# EAGLE design xmega1 (EAGLE 8.4.0)
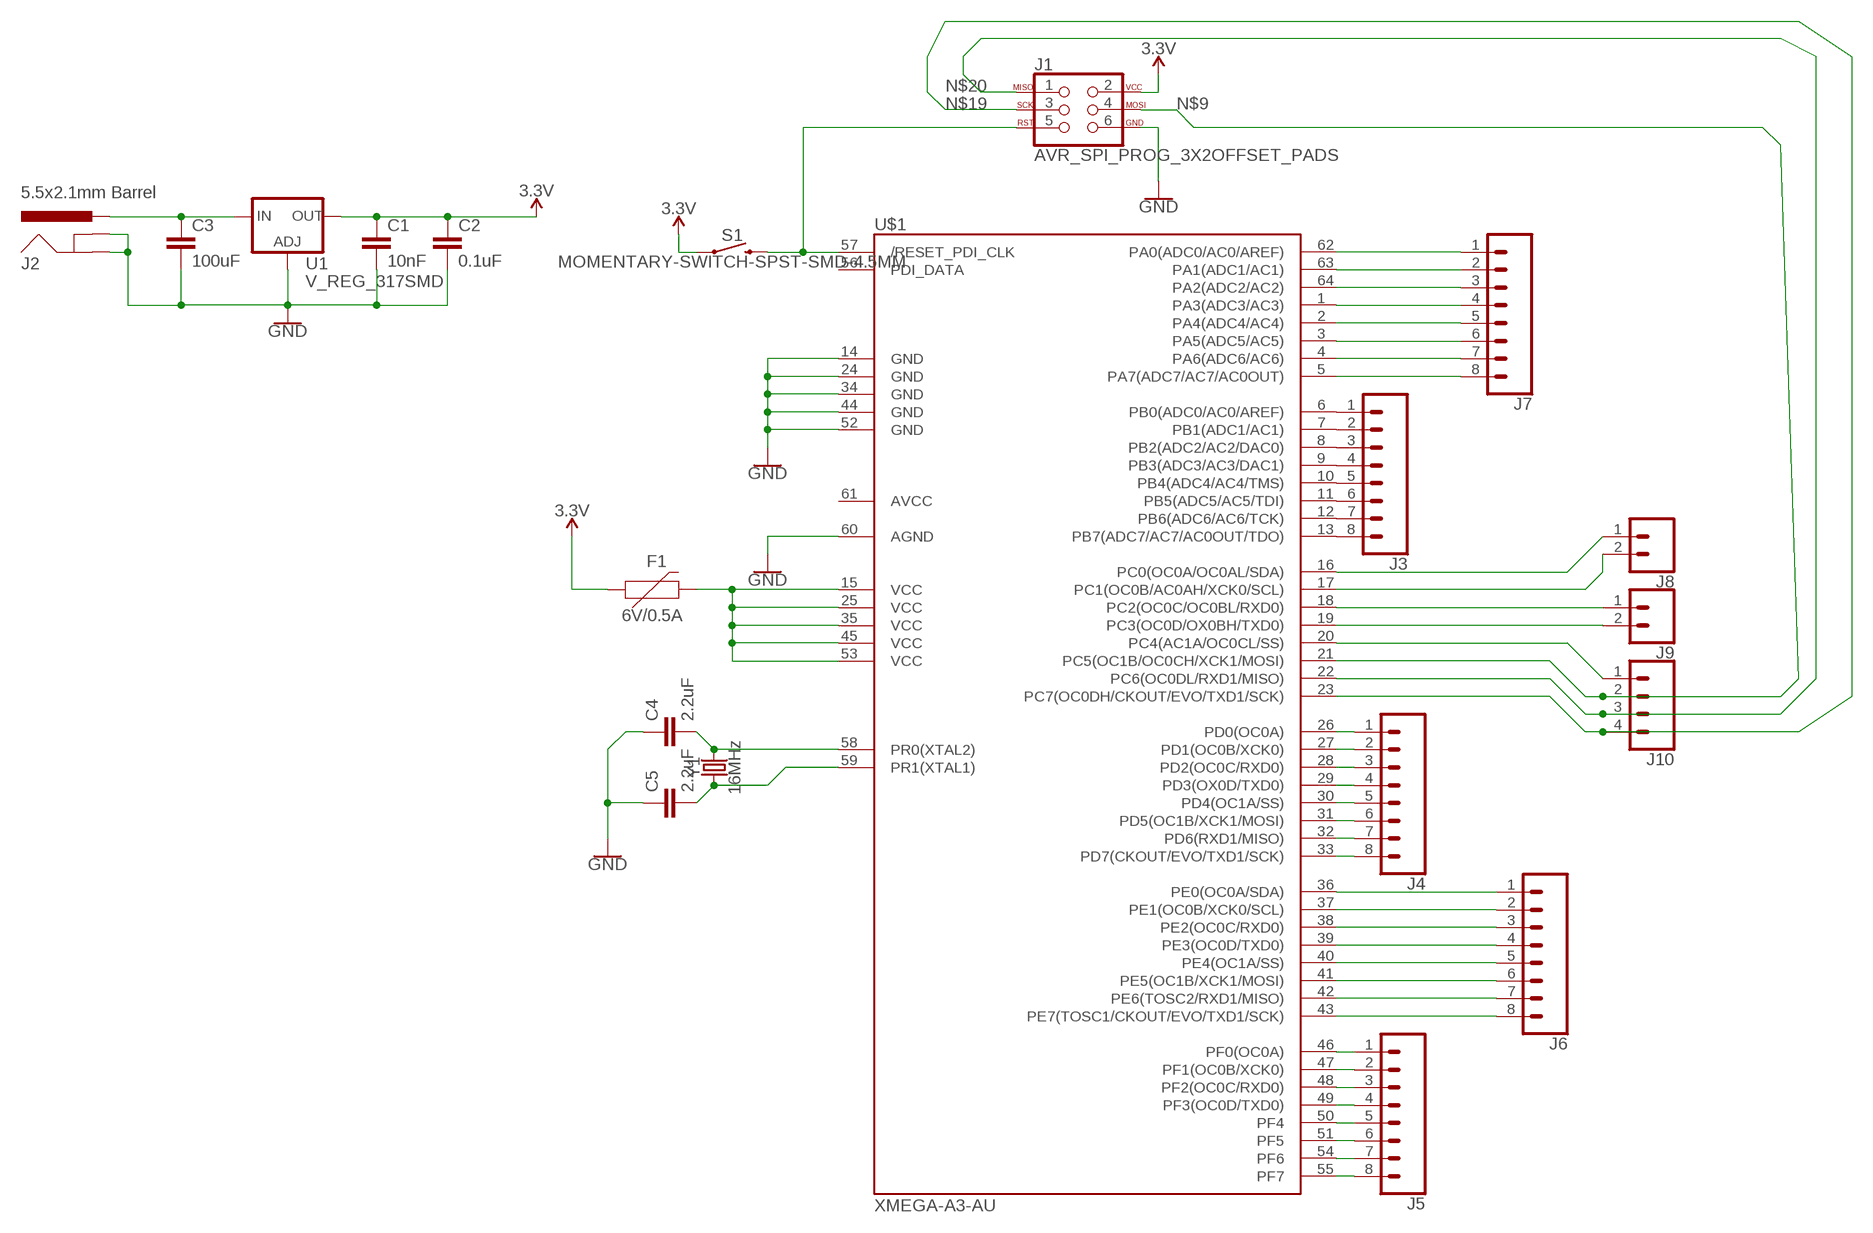
[diagram p0: schematic, sheet 1]

## Parts
C1  10nF  10NF-0603-50V-10%  [0603]
C2  0.1uF  .1UF-CER  [0402-CAP]
C3  100uF  100UF6.3V20%(1210)  [1210]
C4  2.2uF  2.2UF-CERCAP-07888  [0402-CAP]
C5  2.2uF  2.2UF-CERCAP-07888  [0402-CAP]
F1  6V/0.5A  PPTC_HALF-AMP  [1206]
J1  AVR_SPI_PROG_3X2OFFSET_PADS  [2X3_OFFSET]
J2  5.5x2.1mm Barrel  POWER_JACKSMD  [POWER_JACK_SMD]
J3  CONN_08LONGPADS  [1X08_LONGPADS]
J4  CONN_08LONGPADS  [1X08_LONGPADS]
J5  CONN_08LONGPADS  [1X08_LONGPADS]
J6  CONN_08LONGPADS  [1X08_LONGPADS]
J7  CONN_08LONGPADS  [1X08_LONGPADS]
J8  CONN_02PTH3  [1X02_LONGPADS]
J9  CONN_02PTH3  [1X02_LONGPADS]
J10  CONN_04LONGPADS  [1X04_LONGPADS]
S1  MOMENTARY-SWITCH-SPST-SMD-4.5MM  [TACTILE_SWITCH_SMD_4.5MM]
U1  V_REG_317SMD  [SOT223]
U$1  XMEGA-A3-AU  [TQFP64_14X14MM_MCU]
Y1  16MHz  CRYSTAL-16MHZSMD-5X3.2  [CRYSTAL-SMD-5X3.2-4PAD]

## Nets
3.3V: C1.1 C2.1 F1.1 J1.2 S1.2 S1.3 U1.2(OUT)
GND: C1.2 C2.2 C3.2 C4.1 C5.1 J1.6 J2.GND(GNDBREAK) J2.P$4(GND) U1.1(ADJ) U$1.14(GND1) U$1.24(GND2) U$1.34(GND3) U$1.44(GND4) U$1.52(GND5) U$1.60(AGND)
N$1: F1.2 U$1.15(VCC1) U$1.25(VCC2) U$1.35(VCC3) U$1.45(VCC4) U$1.53(VCC5)
N$2: J1.5 S1.1 S1.4 U$1.57(/RESET_PDI_CLK)
N$3: J8.1 U$1.16(PC0(OC0A/OC0AL/SDA))
N$4: C3.1 J2.VIN0(PWR) U1.3(IN)
N$5: J8.2 U$1.17(PC1(OC0B/AC0AH/XCK0/SCL))
N$6: C5.2 U$1.59(PR1(XTAL1)) Y1.1
N$7: C4.2 U$1.58(PR0(XTAL2)) Y1.3
N$8: J3.1 U$1.6(PB0(ADC0/AC0/AREF))
N$9: J1.4 J10.2 U$1.21(PC5(OC1B/OC0CH/XCK1/MOSI))
N$10: J7.1 U$1.62(PA0(ADC0/AC0/AREF))
N$11: J7.2 U$1.63(PA1(ADC1/AC1))
N$12: J7.3 U$1.64(PA2(ADC2/AC2))
N$13: J7.4 U$1.1(PA3(ADC3/AC3))
N$14: J7.5 U$1.2(PA4(ADC4/AC4))
N$15: J7.6 U$1.3(PA5(ADC5/AC5))
N$16: J6.1 U$1.36(PE0(OC0A/SDA))
N$17: J6.2 U$1.37(PE1(OC0B/XCK0/SCL))
N$18: J9.1 U$1.18(PC2(OC0C/OC0BL/RXD0))
N$19: J1.3 J10.4 U$1.23(PC7(OC0DH/CKOUT/EVO/TXD1/SCK))
N$20: J1.1 J10.3 U$1.22(PC6(OC0DL/RXD1/MISO))
N$21: J9.2 U$1.19(PC3(OC0D/OX0BH/TXD0))
N$22: J3.2 U$1.7(PB1(ADC1/AC1))
N$23: J3.3 U$1.8(PB2(ADC2/AC2/DAC0))
N$24: J3.4 U$1.9(PB3(ADC3/AC3/DAC1))
N$25: J3.5 U$1.10(PB4(ADC4/AC4/TMS))
N$26: J3.6 U$1.11(PB5(ADC5/AC5/TDI))
N$27: J3.7 U$1.12(PB6(ADC6/AC6/TCK))
N$28: J3.8 U$1.13(PB7(ADC7/AC7/AC0OUT/TDO))
N$29: J7.7 U$1.4(PA6(ADC6/AC6))
N$30: J7.8 U$1.5(PA7(ADC7/AC7/AC0OUT))
N$31: J4.1 U$1.26(PD0(OC0A))
N$32: J4.2 U$1.27(PD1(OC0B/XCK0))
N$33: J4.3 U$1.28(PD2(OC0C/RXD0))
N$34: J4.4 U$1.29(PD3(OX0D/TXD0))
N$35: J4.5 U$1.30(PD4(OC1A/SS))
N$36: J4.6 U$1.31(PD5(OC1B/XCK1/MOSI))
N$37: J4.7 U$1.32(PD6(RXD1/MISO))
N$38: J4.8 U$1.33(PD7(CKOUT/EVO/TXD1/SCK))
N$39: J6.3 U$1.38(PE2(OC0C/RXD0))
N$40: J6.4 U$1.39(PE3(OC0D/TXD0))
N$41: J6.5 U$1.40(PE4(OC1A/SS))
N$42: J6.6 U$1.41(PE5(OC1B/XCK1/MOSI))
N$43: J6.7 U$1.42(PE6(TOSC2/RXD1/MISO))
N$44: J6.8 U$1.43(PE7(TOSC1/CKOUT/EVO/TXD1/SCK))
N$45: J5.1 U$1.46(PF0(OC0A))
N$46: J5.2 U$1.47(PF1(OC0B/XCK0))
N$47: J5.3 U$1.48(PF2(OC0C/RXD0))
N$48: J5.4 U$1.49(PF3(OC0D/TXD0))
N$49: J5.5 U$1.50(PF4)
N$50: J5.6 U$1.51(PF5)
N$51: J5.7 U$1.54(PF6)
N$52: J5.8 U$1.55(PF7)
N$53: J10.1 U$1.20(PC4(AC1A/OC0CL/SS))
Unconnected: U$1.56(PDI_DATA) U$1.61(AVCC)

## Library data of the parts
C1 = SparkFun-Capacitors:10NF: 0.01uF/10nF/10,000pF ceramic capacitors A capacitor is a passive two-terminal electrical component used to store electrical energy temporarily in an electric field. CAP-09321; PROD_ID: CAP-00867
C2 = SparkFun-Retired:.1UF-CER: .1uF ceramic SMT CAP-00810- 25V +80%/-20% (0603) CAP-08390- 100V 10% (0603) CAP-08604- 25V 5% (0603); PROD_ID: CAP-00810
C3 = SparkFun-Retired:100UF6.3V20%(1210): CAP-09827; PROD_ID: CAP-09827
C4 C5 = SparkFun-Retired:2.2UF-CER: 2.2uF Ceramic SMT CAP-07888- 10V, 20% (0603) CAP-10009- 50V, 10% (1206); PROD_ID: CAP-07888
F1 = SparkFun-Fuses:PPTC: Resettable Fuse PPTC Resettable Fuse. Really a sort of resistor with a polymeric positive temperature coefficient whose resistance increases dramatically with an increase in temperature. When heated by the power passing through the resistance rises causing the current to be limited, protecting the circuit. This is achieved by the transition of the polymer from a crystalline to an amorphous state where the conductive carbon separates breaking the conductive pathways found in the cool crystalline structure. When a PPTC cools back down it resumes conducting letting the circuit turn back on. SparkFun Products: SparkFun RedBoard - Programmed with Arduino <https://www.sparkfun.com/products/12757> Pro Micro - 5V/16MHz <https://www.sparkfun.com/products/12640> Arduino Pro 328 - 5V/16MHz <https://www.sparkfun.com/products/10915> MP3 Trigger <https://www.sparkfun.com/products/13720>; PROD_ID: RES-08585
J1 = SparkFun-Connectors:AVR_SPI_PROG_3X2: AVR ISP 6 Pin This is the reduced ISP connector for AVR programming. Common on Arduino. This footprint will take up less PCB space and can be used with a 10-pin to 6-pin adapter such as SKU: BOB-08508 **Special note about "TEST_POINT" package. The stop mask is on the top side, so if you want your programming test points to be on the bottom of your board, make sure to place this package on the bottom side of the board. This also ensure that the orientation to program from the bottom side will be correct. SparkFun Products: SparkFun ISP Pogo Adapter <https://www.sparkfun.com/products/11591> - NS Tiny AVR Programmer <https://www.sparkfun.com/products/11801> -PTH
J2 = SparkFun-Connectors:POWER_JACK: Power Jack Connector This is the standard 5.5mm barrel jack for power. The PTH is the most common, proven, reliable, footprint. The Slot footprint only works if the mill layer is transmitted to the PCB fab house so be warned. Here are the connectors we sell at SparkFun: DC Barrel Power Jack/Connector <https://www.sparkfun.com/products/119> (PRT-00119) DC Barrel Power Jack/Connector (SMD) <https://www.sparkfun.com/products/12748> (PRT-12748) DC Barrel Jack Adapter - Breadboard Compatible <https://www.sparkfun.com/products/10811> (PRT-10811) It is used on this SparkFun product (and many, many others): SparkFun RedBoard - Programmed with Arduino <https://www.sparkfun.com/products/12757> (DEV-12757) Also, if you need a mating power supply or connector, please check these out: Wall Adapter Power Supply - 9VDC 650mA <https://www.sparkfun.com/products/298> (TOL-00298) DC Barrel Jack Adapter - Male <https://www.sparkfun.com/products/10287> (PRT-10287); PROD_ID: CONN-08106; SF_ID: PRT-12748
J3-J7 = SparkFun-Connectors:CONN_08: Multi connection point. Often used as Generic Header-pin footprint for 0.1 inch spaced/style header connections On any of the 0.1 inch spaced packages, you can populate with these: Break Away Headers - Straight <https://www.sparkfun.com/products/116> (PRT-00116) Break Away Male Headers - Right Angle <https://www.sparkfun.com/products/553> (PRT-00553) Female Headers <https://www.sparkfun.com/products/115> (PRT-00115) Break Away Headers - Machine Pin <https://www.sparkfun.com/products/117> (PRT-00117) Break Away Female Headers - Swiss Machine Pin <https://www.sparkfun.com/products/743> (PRT-00743) Arduino Stackable Header - 8 Pin <https://www.sparkfun.com/products/9279> (PRT-09279) For SCREWTERMINALS and SPRING TERMINALS visit here: Screw Terimnals on SparkFun.com <https://www.sparkfun.com/search/results?term=Screw+Terminals> (5mm/3.5mm/2.54mm spacing) This device is also useful as a general connection point to wire up your design to another part of your project. Our various solder wires solder well into these plated through hole pads. Hook-Up Wire - Assortment (Stranded, 22 AWG) <https://www.sparkfun.com/products/11375> (PRT-11375) Hook-Up Wire - Assortment (Solid Core, 22 AWG) <https://www.sparkfun.com/products/11367> (PRT-11367) View the entire wire category on our website here <https://www.sparkfun.com/categories/141> Special notes: Molex polarized connector foot print use with SKU : PRT-08231 with associated crimp pins and housings. 1MM SMD Version SKU: PRT-10208 NOTES ON THE VARIANTS LOCK and LOCK_LONGPADS... This footprint was designed to help hold the alignment of a through-hole component (i.e. 6-pin header) while soldering it into place. You may notice that each hole has been shifted either up or down by 0.005 of an inch from it's more standard position (which is a perfectly straight line). This slight alteration caused the pins (the squares in the middle) to touch the edges of the holes. Because they are alternating, it causes a "brace" to hold the component in place. 0.005 has proven to be the perfect amount of "off-center" position when using our standard breakaway headers. Although looks a little odd when you look at the bare footprint, once you have a header in there, the alteration is very hard to notice. Also,if you push a header all the way into place, it is covered up entirely on the bottom side.
J8 J9 = SparkFun-Connectors:CONN_02: Multi connection point. Often used as Generic Header-pin footprint for 0.1 inch spaced/style header connections On any of the 0.1 inch spaced packages, you can populate with these: Break Away Headers - Straight <https://www.sparkfun.com/products/116> (PRT-00116) Break Away Male Headers - Right Angle <https://www.sparkfun.com/products/553> (PRT-00553) Female Headers <https://www.sparkfun.com/products/115> (PRT-00115) Break Away Headers - Machine Pin <https://www.sparkfun.com/products/117> (PRT-00117) Break Away Female Headers - Swiss Machine Pin <https://www.sparkfun.com/products/743> (PRT-00743) For SCREWTERMINALS and SPRING TERMINALS visit here: Screw Terimnals on SparkFun.com <https://www.sparkfun.com/search/results?term=Screw+Terminals> (5mm/3.5mm/2.54mm spacing) This device is also useful as a general connection point to wire up your design to another part of your project. Our various solder wires solder well into these plated through hole pads. Hook-Up Wire - Assortment (Stranded, 22 AWG) <https://www.sparkfun.com/products/11375> (PRT-11375) Hook-Up Wire - Assortment (Solid Core, 22 AWG) <https://www.sparkfun.com/products/11367> (PRT-11367) View the entire wire category on our website here <https://www.sparkfun.com/categories/141> Special notes: Molex polarized connector foot print use with: PRT-08233 with associated crimp pins and housings. 2.54_SCREWTERM for use with PRT-10571. 3.5mm Screw Terminal footprints for PRT-08084 5mm Screw Terminal footprints for use with PRT-08432
J10 = SparkFun-Connectors:CONN_04: Multi connection point. Often used as Generic Header-pin footprint for 0.1 inch spaced/style header connections On any of the 0.1 inch spaced packages, you can populate with these: Break Away Headers - Straight <https://www.sparkfun.com/products/116> (PRT-00116) Break Away Male Headers - Right Angle <https://www.sparkfun.com/products/553> (PRT-00553) Female Headers <https://www.sparkfun.com/products/115> (PRT-00115) Break Away Headers - Machine Pin <https://www.sparkfun.com/products/117> (PRT-00117) Break Away Female Headers - Swiss Machine Pin <https://www.sparkfun.com/products/743> (PRT-00743) For SCREWTERMINALS and SPRING TERMINALS visit here: Screw Terimnals on SparkFun.com <https://www.sparkfun.com/search/results?term=Screw+Terminals> (5mm/3.5mm/2.54mm spacing) This device is also useful as a general connection point to wire up your design to another part of your project. Our various solder wires solder well into these plated through hole pads. Hook-Up Wire - Assortment (Stranded, 22 AWG) <https://www.sparkfun.com/products/11375> (PRT-11375) Hook-Up Wire - Assortment (Solid Core, 22 AWG) <https://www.sparkfun.com/products/11367> (PRT-11367) View the entire wire category on our website here <https://www.sparkfun.com/categories/141> Special notes: Molex polarized connector foot print use with SKU : PRT-08231 with associated crimp pins and housings. 1MM SMD Version SKU: PRT-10208; PROD_ID: CONN-09696
S1 = SparkFun-Switches:MOMENTARY-SWITCH-SPST: Momentary Switch (Pushbutton) - SPST Normally-open (NO) SPST momentary switches (buttons, pushbuttons). Variants PTH-12MM - 12mm square, through-hole Momentary Pushbutton Switch - 12mm Square <https://www.sparkfun.com/products/9190> (COM-09190) PTH-6.0MM, PTH-6.0MM-KIT - 6.0mm square, through-hole Mini Pushbutton Switch <https://www.sparkfun.com/products/97> (COM-00097) KIT package intended for soldering kit's - only one side of pads' copper is exposed. PTH-RIGHT-ANGLE-KIT - Right-angle, through-hole Right Angle Tactile Button <https://www.sparkfun.com/products/10791> - Used on SparkFun BigTime Watch Kit <https://www.sparkfun.com/products/11734> SMD-12MM - 12mm square, surface-mount Tactile Button - SMD (12mm) <https://www.sparkfun.com/products/12993> (COM-12993) Used on SparkFun PicoBoard <https://www.sparkfun.com/products/11888> SMD-4.5MM - 4.5mm Square Trackball Switch Used on SparkFun Blackberry Trackballer Breakout <https://www.sparkfun.com/products/13169> SMD-4.6MMX2.8MM - 4.60mm x 2.80mm, surface mount Used on SparkFun SAMD21 Mini Breakout <https://www.sparkfun.com/products/13664> SMD-5.2MM, SMD-5.2-REDUNDANT - 5.2mm square, surface-mount Mini Pushbutton Switch - SMD <https://www.sparkfun.com/products/8720> (COM-08720) Used on Arduino Pro Mini <https://www.sparkfun.com/products/11114> REDUNDANT package connects both switch circuits together SMD-6.0X3.5MM - 6.0 x 3.5mm, surface mount Momentary Reset Switch SMD <https://www.sparkfun.com/products/8229> (COM-08229) SMD-6.2MM-TALL - 6.2mm square, surface mount Tactile Button - SMD (6mm) <https://www.sparkfun.com/products/12992> Used on SparkFun Digital Sandbox <https://www.sparkfun.com/products/12651> SMD-RIGHT-ANGLE - Right-angle, surface mount Used on SparkFun Block for Intel® Edison - Arduino <https://www.sparkfun.com/products/13036>; PROD_ID: SWCH-09213
U1 = SparkFun-IC-Power:V_REG_317: Voltage Regulator Standard LM317 adjustable voltage regulator. AOI (Adjust Output Input). Google 'LM317 Calculator' for easy to use app to get the two resistor values needed. 240/720 for 5V output. 240/390 for 3.3V output. Spark Fun Electronics SKU : COM-00527
U$1 = SparkFun-Retired:XMEGA-A3: Atmel's 8/16-bit AVR XMEGA A3 Microcontroller - ATxmega256A3, etc. Retired: IC-09806 - ATXMEGA256A3 Retired: IC-09429 - ATXMEGA128A1
Y1 = SparkFun-Clocks:CRYSTAL-16MHZ: 16MHz Crystal Digikey Example <http://www.digikey.com/product-search/en?keywords=535-9122-1-ND> Frequency: 16MHz Frequency Stability: ±50ppm Frequency Tolerance: ±20ppm Load Capacitance: 18pF SparkFun Products: Pro Micro -5V/16MHz <https://www.sparkfun.com/products/12640> SparkFun Serial Enabled LCD Kit <https://www.sparkfun.com/products/10097>; PROD_ID: XTAL-08218; SF_ID: COM-00094

## Board
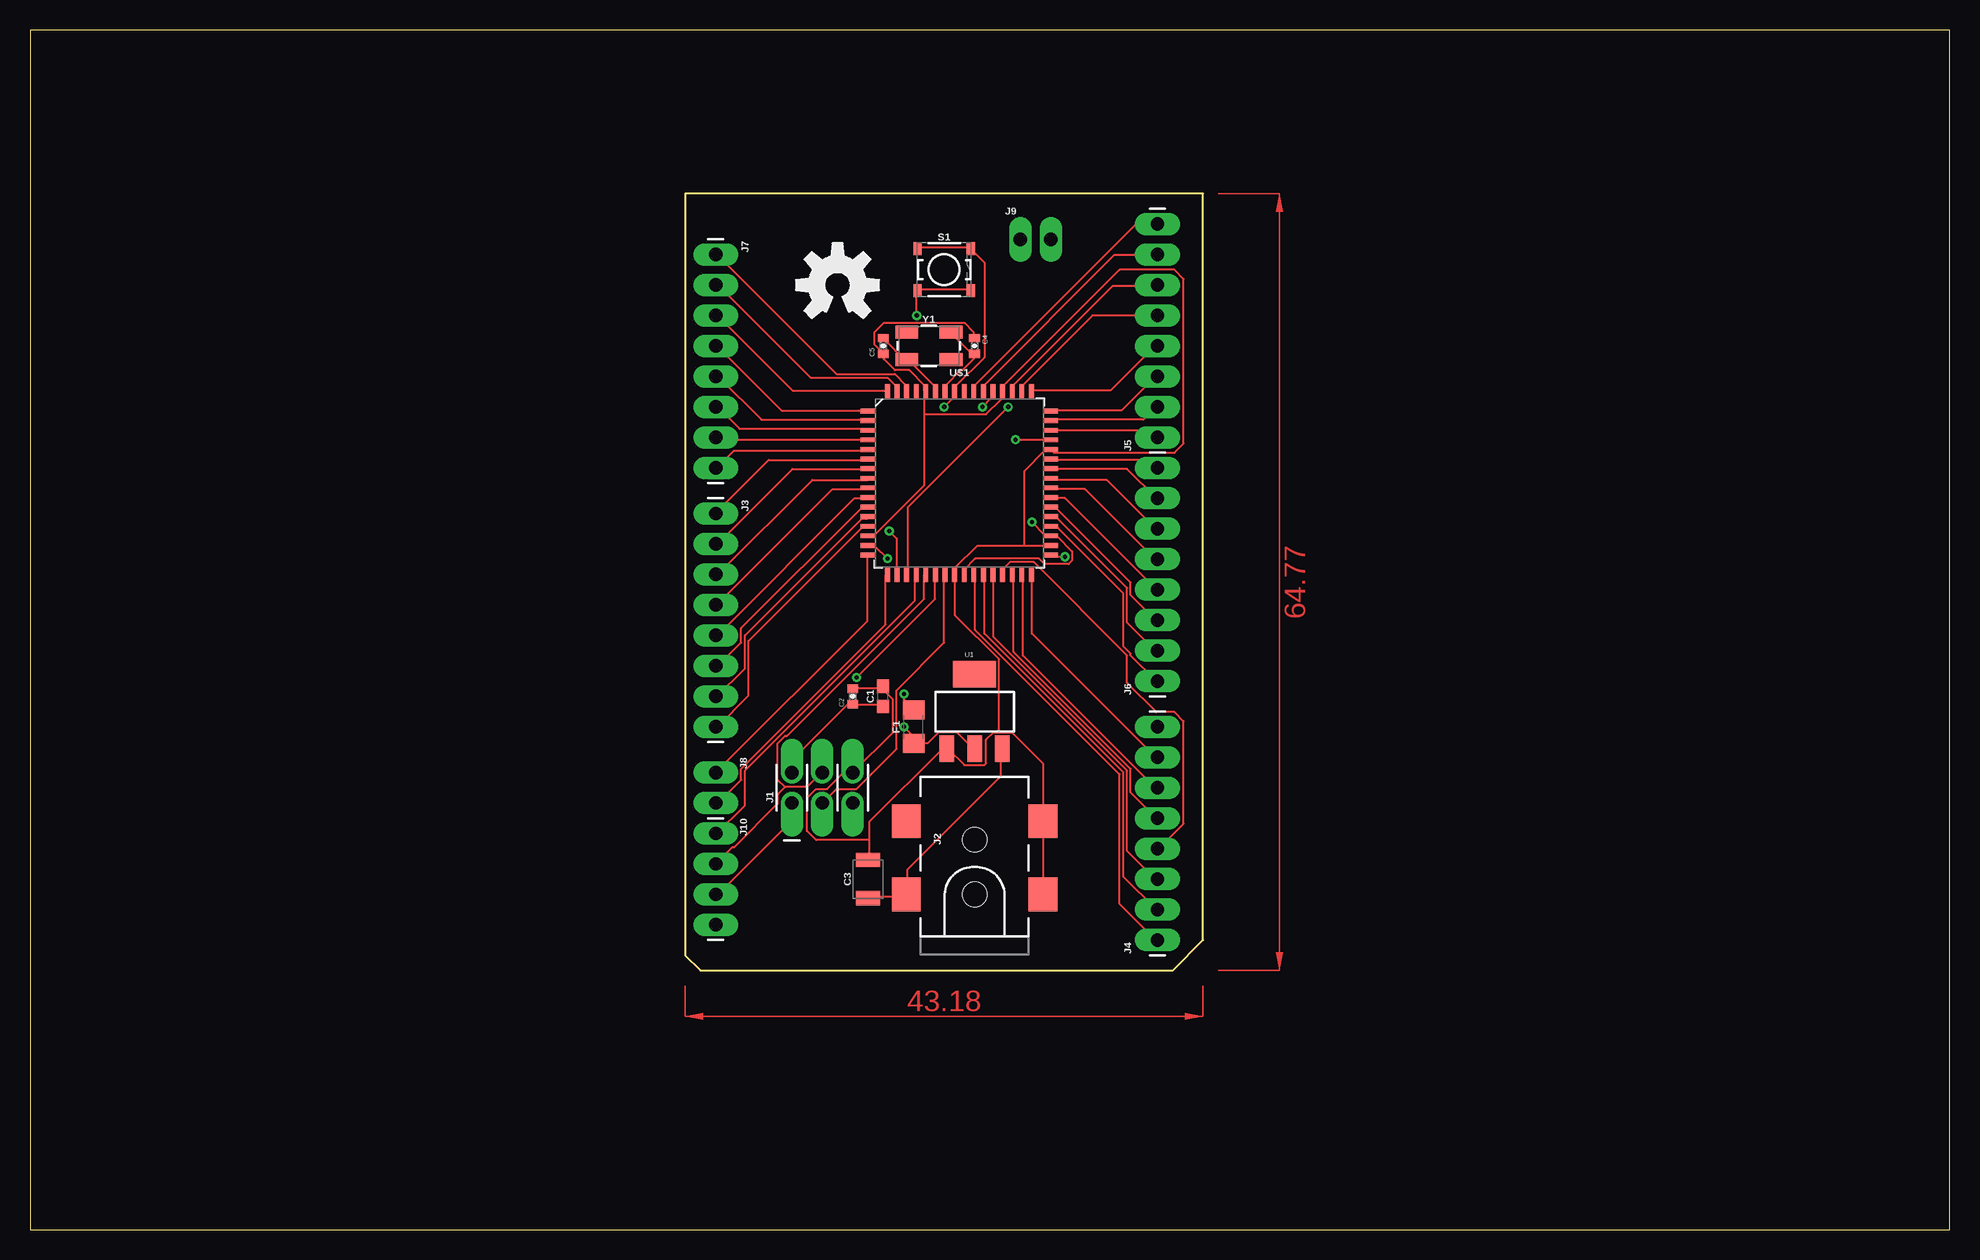
[diagram p1: board, top side]
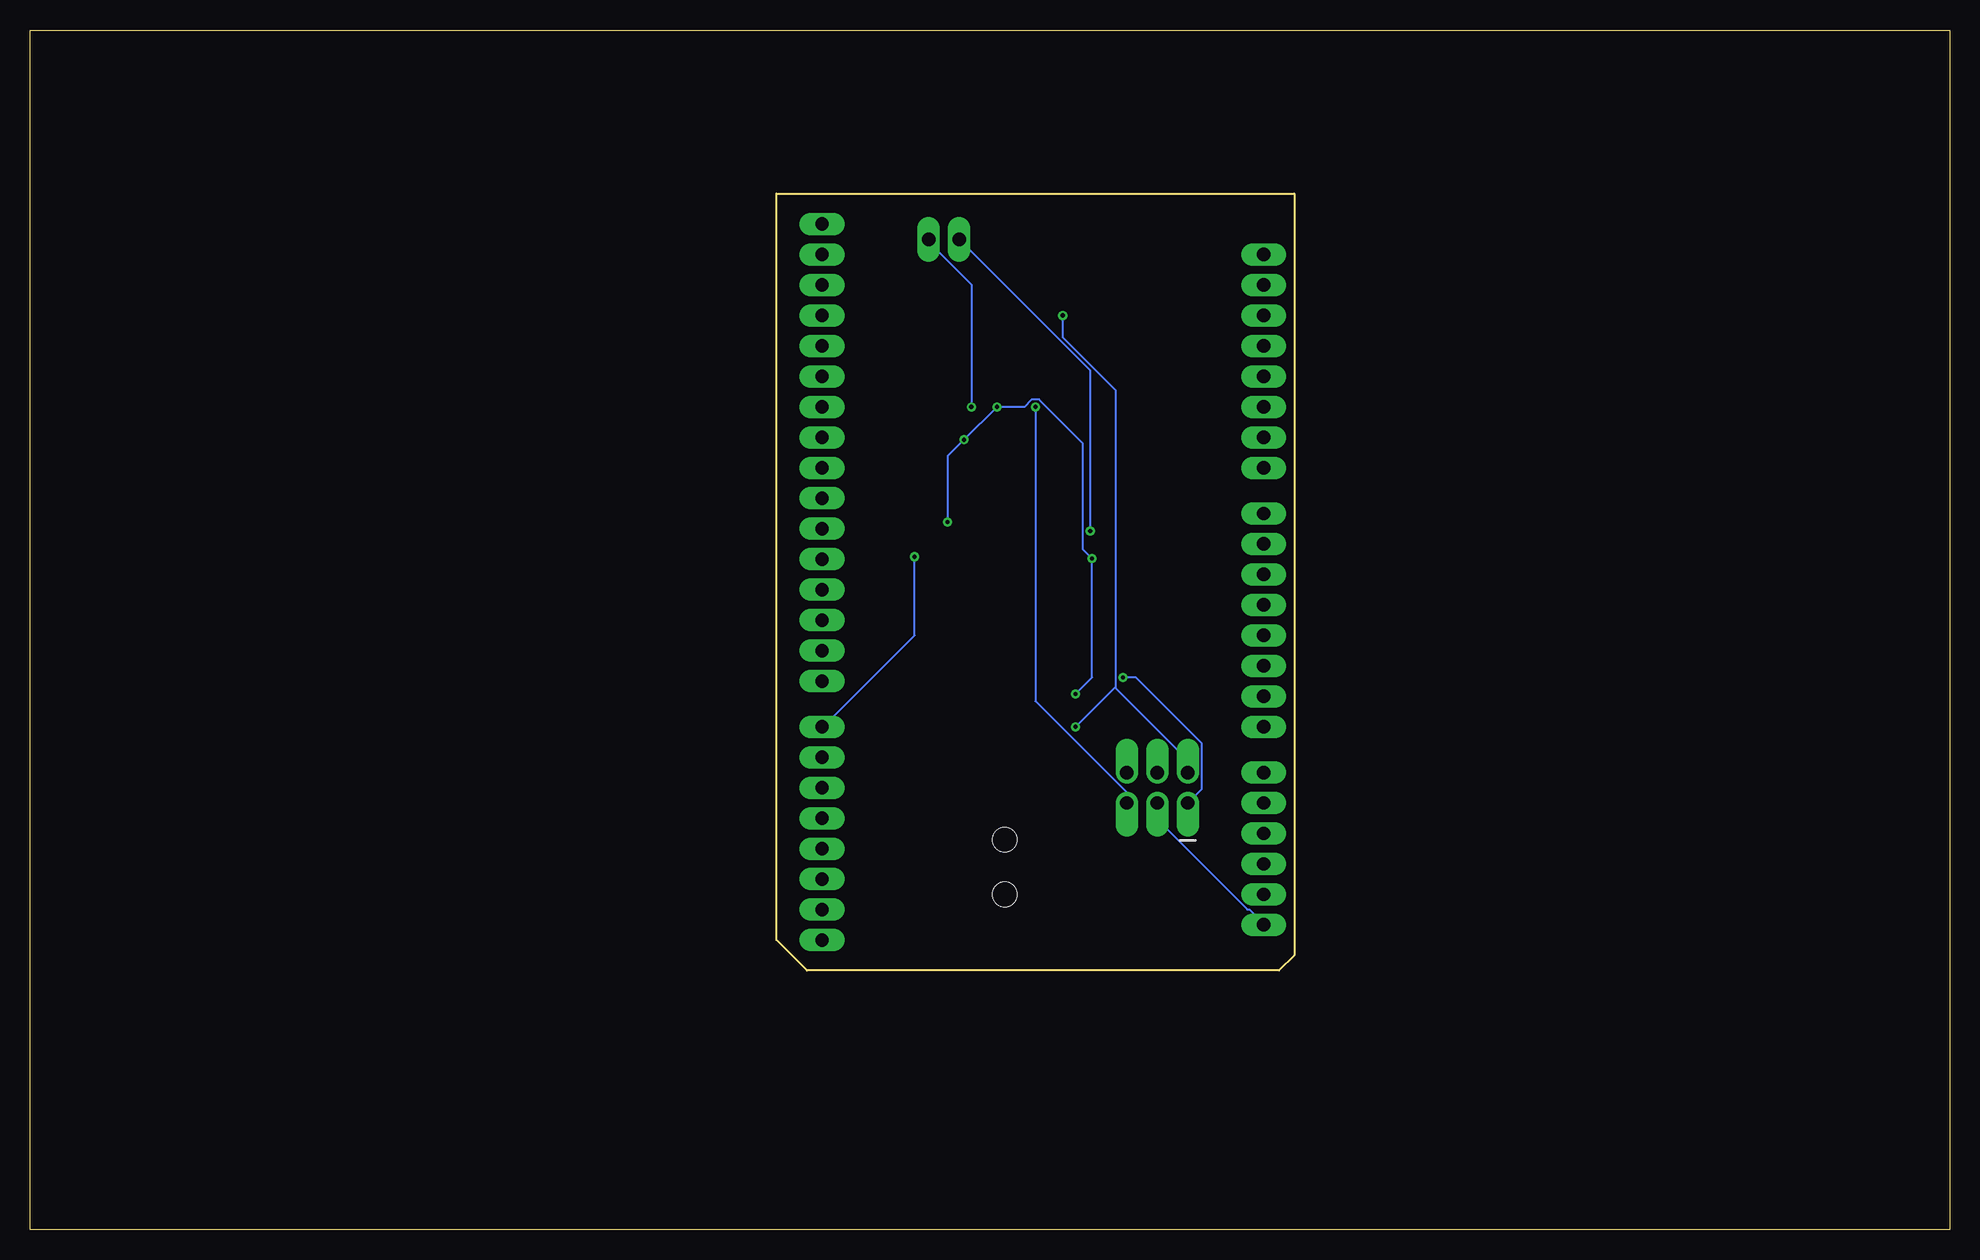
[diagram p2: board, bottom side, seen from below]

Size 160 x 100 mm. Coordinates in mm from the lower left corner, seen from the top.
Outline: 0,0 160,0 160,100 0,100 0,0
Outline: 97.79,86.36 54.61,86.36 54.61,22.86 55.88,21.59 95.25,21.59 97.79,24.13 97.79,86.36
Copper layers (1*16): Top 0.035mm / dielectric 1.5mm / Bottom 0.035mm
Design rules "default": minimum track width 6mil, minimum drill 0.35mm, track to track 6mil, track to pad 6mil, pad to pad 6mil, via to via 6mil, smd to smd 6mil, copper to edge 40mil, drill to drill 6mil, minimum pad ring 10mil, minimum via ring 8mil, stop-mask expansion 4mil, vias tented up to drill 0mil, thermal gap 10mil

### Footprints (pad centres in the part's own frame; a part is rotated, then mirrored left to right if it is on the bottom)
0603 = smd 1.1 x 1: 1 -0.85,0; 2 0.85,0
0402-CAP = smd 0.7 x 0.9: 1 -0.65,0; 2 0.65,0
1210 = smd 1.2 x 2: 1 -1.6,0; 2 1.6,0
1206 = smd 1.6 x 1.8: 1 -1.4,0; 2 1.4,0
2X3_OFFSET = drill 1.118 pad 1.88 offset: 1 -2.54,-1.27; 2 -2.54,1.27; 3 0,-1.27; 4 0,1.27; 5 2.54,-1.27; 6 2.54,1.27
POWER_JACK_SMD = smd 2.8 x 2.4: GND 0,-5.7; P$4 6.1,-5.7; VIN0 0,5.7; VIN1 6.1,5.7 | hole 2.032: 0,0; 4.572,0
1X08_LONGPADS = drill 1.118 pad 1.88 long: 1 0,0; 2 2.54,0; 3 5.08,0; 4 7.62,0; 5 10.16,0; 6 12.7,0; 7 15.24,0; 8 17.78,0
1X02_LONGPADS = drill 1.118 pad 1.88 long: 1 0,0; 2 2.54,0
1X04_LONGPADS = drill 1.118 pad 1.88 long: 1 0,0; 2 2.54,0; 3 5.08,0; 4 7.62,0
TACTILE_SWITCH_SMD_4.5MM = smd 0.7 x 1.1: 1 2.225,1.75; 2 2.225,-1.75; 3 -2.225,-1.75; 4 -2.225,1.75
SOT223 = smd 1.219 x 2.235: 1 -2.311,-3.099; 2 0,-3.099; 3 2.311,-3.099 | smd 3.6 x 2.2: 4 0,3.099
TQFP64_14X14MM_MCU = smd 0.4 x 1.27: 1 -6,-7.6; 2 -5.2,-7.6; 3 -4.4,-7.6; 4 -3.6,-7.6; 5 -2.8,-7.6; 6 -2,-7.6; 7 -1.2,-7.6; 8 -0.4,-7.6; 9 0.4,-7.6; 10 1.2,-7.6; 11 2,-7.6; 12 2.8,-7.6; 13 3.6,-7.6; 14 4.4,-7.6; 15 5.2,-7.6; 16 6,-7.6; 33 6,7.6; 34 5.2,7.6; 35 4.4,7.6; 36 3.6,7.6; 37 2.8,7.6; 38 2,7.6; 39 1.2,7.6; 40 0.4,7.6; 41 -0.4,7.6; 42 -1.2,7.6; 43 -2,7.6; 44 -2.8,7.6; 45 -3.6,7.6; 46 -4.4,7.6; 47 -5.2,7.6; 48 -6,7.6 | smd 1.27 x 0.4: 17 7.6,-6; 18 7.6,-5.2; 19 7.6,-4.4; 20 7.6,-3.6; 21 7.6,-2.8; 22 7.6,-2; 23 7.6,-1.2; 24 7.6,-0.4; 25 7.6,0.4; 26 7.6,1.2; 27 7.6,2; 28 7.6,2.8; 29 7.6,3.6; 30 7.6,4.4; 31 7.6,5.2; 32 7.6,6; 49 -7.6,6; 50 -7.6,5.2; 51 -7.6,4.4; 52 -7.6,3.6; 53 -7.6,2.8; 54 -7.6,2; 55 -7.6,1.2; 56 -7.6,0.4; 57 -7.6,-0.4; 58 -7.6,-1.2; 59 -7.6,-2; 60 -7.6,-2.8; 61 -7.6,-3.6; 62 -7.6,-4.4; 63 -7.6,-5.2; 64 -7.6,-6
CRYSTAL-SMD-5X3.2-4PAD = smd 1.9 x 1.1: 1 -1.85,-1.15; 2 1.85,-1.15; 3 1.85,1.15; 4 -1.85,1.15

### Placement (x,y rotation side)
C1  71.12,44.45 90 top
C2  68.58,44.45 90 top
C3  69.85,29.21 90 top
C4  78.74,73.66 270 top
C5  71.12,73.66 90 top
F1  73.66,41.91 90 top
J1  66.04,36.83 0 top
J2  78.74,27.94 90 top
J3  57.15,59.69 270 top
J4  93.98,24.13 90 top
J5  93.98,66.04 90 top
J6  93.98,45.72 90 top
J7  57.15,81.28 270 top
J8  57.15,38.1 270 top
J9  82.55,82.55 0 top
J10  57.15,33.02 270 top
S1  76.2,80.01 0 top
U1  78.74,43.18 0 top
U$1  77.47,62.23 270 top
U$2  [OSHW-LOGO-L_COPPER]  67.31,78.74 0 top
U$3  [OSHW-LOGO-L]  67.31,78.74 0 top
Y1  74.93,73.66 0 top

### Tracks (layer width: path | path; a pad name or v marks a point on that pad's centre or on a via)
3.3V  (via drill 0.35)
  Top 0.152: U1.2 78.64,40.08 77.27,41.45 75.74,41.45 74.83,40.54 73.76,40.54 F1.1 73.61,40.54 73.61,41.15 v72.85,41.91 | S1.2 78.33,78.33 74.07,78.33 S1.3 73.91,78.18 v73.91,76.2 | 68.58,43.74 71.02,43.74 C1.1 | 68.58,43.74 68.12,43.74 63.55,39.17 63.55,38.1 J1.2 | 68.58,43.74 C2.1
  Bottom 0.152: v73.91,76.2 73.91,74.37 69.49,69.95 69.49,45.26 | 69.49,45.26 69.49,45.11 63.55,39.17 63.55,38.1 J1.2 | 69.49,45.26 v72.85,41.91
GND
  Top 0.152: C4.1 78.64,74.37 78.64,74.83 77.88,75.59 71.17,75.59 70.41,74.83 70.41,73.76 71.02,73.15 C5.1 71.17,73 71.17,72.54 72.08,71.63 73.3,71.63 74.52,70.41 74.52,69.95 U$1.60 74.52,69.8 74.52,67.97 | 74.52,67.97 74.52,62.03 70.41,57.91 69.95,57.91 U$1.14 | 74.52,67.97 79.7,67.97 80.92,69.19 80.92,69.8 U$1.52 81.08,69.95 81.08,70.26 90.83,80.01 95.4,80.01 96.16,79.25 96.16,65.53 95.4,64.77 85.34,64.77 85.19,64.92 U$1.44 85.04,64.92 84.58,64.92 82.91,63.25 82.91,57 | 82.91,57 85.04,57 U$1.34 | 82.91,57 78.94,57 77.11,55.17 77.11,54.71 U$1.24 77.11,54.56 77.11,51.21 80.77,47.55 80.77,41.45 | C2.2 70.87,45.11 71.02,45.26 C1.2 71.17,45.26 71.17,44.96 71.93,44.2 71.93,41.45 J1.6 67.82,38.1 66.45,36.73 65.53,36.73 64.77,35.97 64.77,33.22 65.53,32.46 69.95,32.46 | J2.GND 84.43,28.04 84.43,33.98 J2.P$4 84.43,34.14 84.43,38.86 81.84,41.45 80.77,41.45 | 69.95,32.46 69.95,33.98 76.05,40.08 U1.1 76.5,40.08 77.88,38.71 79.55,38.71 79.7,38.86 79.7,40.84 80.31,41.45 80.77,41.45 | 69.95,32.46 69.95,30.94 C3.2
N$1  (via drill 0.35)
  Top 0.152: U$1.25 77.88,54.71 77.88,55.02 78.79,55.93 84.12,55.93 84.58,55.47 86.56,55.47 86.87,55.78 86.87,56.54 85.65,57.76 85.19,57.76 U$1.35 85.04,57.91 84.58,57.91 v83.52,58.98 | v71.48,55.93 70.41,57 69.95,57 U$1.15 | v72.85,44.65 72.85,44.2 73.61,43.43 F1.2 | v79.4,68.58 80.16,69.34 80.16,69.8 U$1.53 | v82.14,65.84 85.04,65.84 U$1.45
  Bottom 0.152: v72.85,44.65 71.48,46.02 v71.48,55.93 72.24,56.69 72.24,65.53 75.89,69.19 76.5,69.19 77.11,68.58 v79.4,68.58 v82.14,65.84 83.52,64.47 v83.52,58.98
N$2  (via drill 0.35)
  Top 0.152: S1.4 74.07,81.84 78.33,81.84 S1.1 78.49,81.69 79.55,80.62 79.55,72.69 77.11,70.26 77.11,69.95 U$1.57 76.96,69.8 76.96,69.34 v76.2,68.58
  Bottom 0.152: J1.5 68.58,36.42 76.2,44.04 v76.2,68.58
N$3
  Top 0.152: J8.1 69.8,50.75 69.8,56.08 U$1.16
N$4
  Top 0.152: C3.1 69.95,27.74 72.85,27.74 73,27.89 J2.VIN0 73.15,28.04 73.15,30.02 80.92,37.8 80.92,40.08 U1.3
N$5
  Top 0.152: U$1.17 71.32,54.56 71.32,50.44 59.28,38.41 59.28,37.49 57.45,35.66 57.15,35.66 J8.2
N$6
  Top 0.152: C5.2 71.17,74.22 73,72.39 Y1.1 73.15,72.54 75.44,70.26 75.44,69.95 U$1.59
N$7
  Top 0.152: Y1.3 76.81,74.68 78.33,73.15 78.64,73.15 C4.2 78.64,73 78.64,72.54 77.72,71.63 77.57,71.63 76.35,70.41 76.35,69.95 U$1.58
N$8
  Top 0.152: U$1.6 69.8,64.16 61.57,64.16 57.15,59.74 J3.1
N$9
  Top 0.152: 62.94,36.88 62.33,37.49 62.33,40.54 62.94,41.15 63.09,41.15 74.52,52.58 74.52,54.56 U$1.21 | 62.94,36.88 64.77,36.88 65.99,38.1 J1.4 | J10.2 58.52,31.85 58.67,31.85 62.33,35.51 62.33,36.27 62.94,36.88
N$10
  Top 0.152: U$1.62 73,69.95 73,70.41 72.08,71.32 67.21,71.32 57.15,81.38 J7.1
N$11
  Top 0.152: U$1.63 72.24,69.95 72.24,70.26 71.48,71.02 65.08,71.02 57.45,78.64 57.15,78.64 J7.2
N$12
  Top 0.152: J7.3 57.3,76.2 63.55,69.95 71.32,69.95 U$1.64
N$13
  Top 0.152: U$1.1 69.8,68.28 62.64,68.28 57.15,73.76 J7.4
N$14
  Top 0.152: U$1.2 69.8,67.51 60.96,67.51 57.45,71.02 57.15,71.02 J7.5
N$15
  Top 0.152: J7.6 57.3,68.58 59.13,66.75 69.8,66.75 U$1.3
N$16
  Top 0.152: U$1.36 85.19,58.52 85.65,58.52 91.14,53.03 91.14,48.62 91.75,48.01 91.75,47.85 93.88,45.72 J6.1
N$17
  Top 0.152: U$1.37 85.19,59.28 85.65,59.28 91.44,53.49 91.44,50.6 93.88,48.16 J6.2
N$18  (via drill 0.35)
  Top 0.152: v71.63,58.22 72.24,57.61 72.24,54.71 U$1.18
  Bottom 0.152: v71.63,58.22 71.63,71.63 J9.1
N$19
  Top 0.152: J1.3 67.21,36.73 68.89,36.73 72.24,40.08 72.24,44.96 76.2,48.92 76.2,54.56 U$1.23
  Bottom 0.152: J10.4 57.15,25.45 58.37,26.67 58.52,26.67 65.99,34.14 65.99,35.51 J1.3
N$20  (via drill 0.35)
  Top 0.152: v68.89,46.02 75.44,52.58 75.44,54.56 U$1.22 | J10.3 57.15,28.04 57.45,28.04 63.4,33.98 63.4,35.51 J1.1
  Bottom 0.152: v68.89,46.02 67.82,46.02 62.33,40.54 62.33,36.73 J1.1
N$21  (via drill 0.35)
  Top 0.152: v81.53,68.58 73.15,60.2 73.15,54.71 U$1.19
  Bottom 0.152: v81.53,68.58 81.53,78.79 85.19,82.45 J9.2
N$22
  Top 0.152: J3.2 57.3,57.15 63.55,63.4 69.8,63.4 U$1.7
N$23
  Top 0.152: U$1.8 69.8,62.48 65.23,62.48 57.45,54.71 57.15,54.71 J3.3
N$24
  Top 0.152: U$1.9 69.8,61.72 66.9,61.72 57.15,51.97 J3.4
N$25
  Top 0.152: J3.5 57.3,49.53 68.73,60.96 69.8,60.96 U$1.10
N$26
  Top 0.152: U$1.11 69.8,60.2 69.34,60.2 59.28,50.14 59.28,48.92 57.45,47.09 57.15,47.09 J3.6
N$27
  Top 0.152: U$1.12 69.8,59.28 69.34,59.28 59.59,49.53 59.59,46.79 57.15,44.35 J3.7
N$28
  Top 0.152: J3.8 57.3,41.91 59.89,44.5 59.89,49.07 69.34,58.52 69.8,58.52 U$1.13
N$29
  Top 0.152: U$1.4 69.8,65.84 57.3,65.84 57.15,65.99 J7.7
N$30
  Top 0.152: U$1.5 69.8,64.92 58.67,64.92 57.15,63.4 J7.8
N$31
  Top 0.152: U$1.26 78.79,54.56 78.79,49.99 90.83,37.95 90.83,27.13 93.88,24.08 J4.1
N$32
  Top 0.152: U$1.27 79.55,54.56 79.55,49.68 91.14,38.1 91.14,29.41 93.88,26.67 J4.2
N$33
  Top 0.152: U$1.28 80.31,54.56 80.31,49.38 91.44,38.25 91.44,31.55 93.88,29.11 J4.3
N$34
  Top 0.152: U$1.29 81.08,54.71 81.08,55.02 81.69,55.63 83.67,55.63 91.44,47.85 91.44,45.57 93.88,43.13 95.4,43.13 96.16,42.37 96.16,33.83 94.03,31.7 J4.4
N$35
  Top 0.152: U$1.30 81.99,54.56 81.99,48.16 91.75,38.41 91.75,36.42 93.88,34.29 J4.5
N$36
  Top 0.152: U$1.31 82.75,54.56 82.75,47.85 93.88,36.73 J4.6
N$37
  Top 0.152: U$1.32 83.52,54.56 83.52,49.68 93.88,39.32 J4.7
N$38  (via drill 0.35)
  Top 0.152: v86.26,56.08 85.19,56.08 U$1.33
  Bottom 0.152: v86.26,56.08 86.26,49.53 93.88,41.91 J4.8
N$39
  Top 0.152: U$1.38 85.19,60.2 85.5,60.2 91.75,53.95 91.75,52.88 93.88,50.75 J6.3
N$40
  Top 0.152: U$1.39 85.19,60.96 86.26,60.96 93.88,53.34 J6.4
N$41
  Top 0.152: U$1.40 85.19,61.72 87.94,61.72 93.88,55.78 J6.5
N$42
  Top 0.152: U$1.41 85.19,62.48 89.76,62.48 93.88,58.37 J6.6
N$43
  Top 0.152: U$1.42 85.19,63.4 91.44,63.4 93.88,60.96 J6.7
N$44
  Top 0.152: U$1.43 85.19,64.16 93.27,64.16 93.88,63.55 J6.8
N$45
  Top 0.152: J5.1 93.42,66.6 85.19,66.6 U$1.46
N$46
  Top 0.152: U$1.47 85.19,67.51 92.81,67.51 93.88,68.58 J5.2
N$47
  Top 0.152: U$1.48 85.19,68.28 90.98,68.28 93.88,71.17 J5.3
N$48
  Top 0.152: U$1.49 83.52,69.95 90.07,69.95 93.88,73.76 J5.4
N$49
  Top 0.152: J5.5 88.54,76.2 82.75,70.41 82.75,69.95 U$1.50
N$50
  Top 0.152: U$1.51 81.99,69.95 81.99,70.41 90.22,78.64 93.88,78.64 J5.6
N$51
  Top 0.152: U$1.54 79.55,69.95 79.55,70.41 90.37,81.23 93.88,81.23 J5.7
N$52
  Top 0.152: J5.8 92.2,83.82 78.79,70.41 78.79,69.95 U$1.55
N$53
  Top 0.152: U$1.20 73.76,54.56 73.76,52.43 59.59,38.25 59.59,35.36 57.15,32.92 J10.1
(copper drawn outside any net)
  shapes: Top area x2